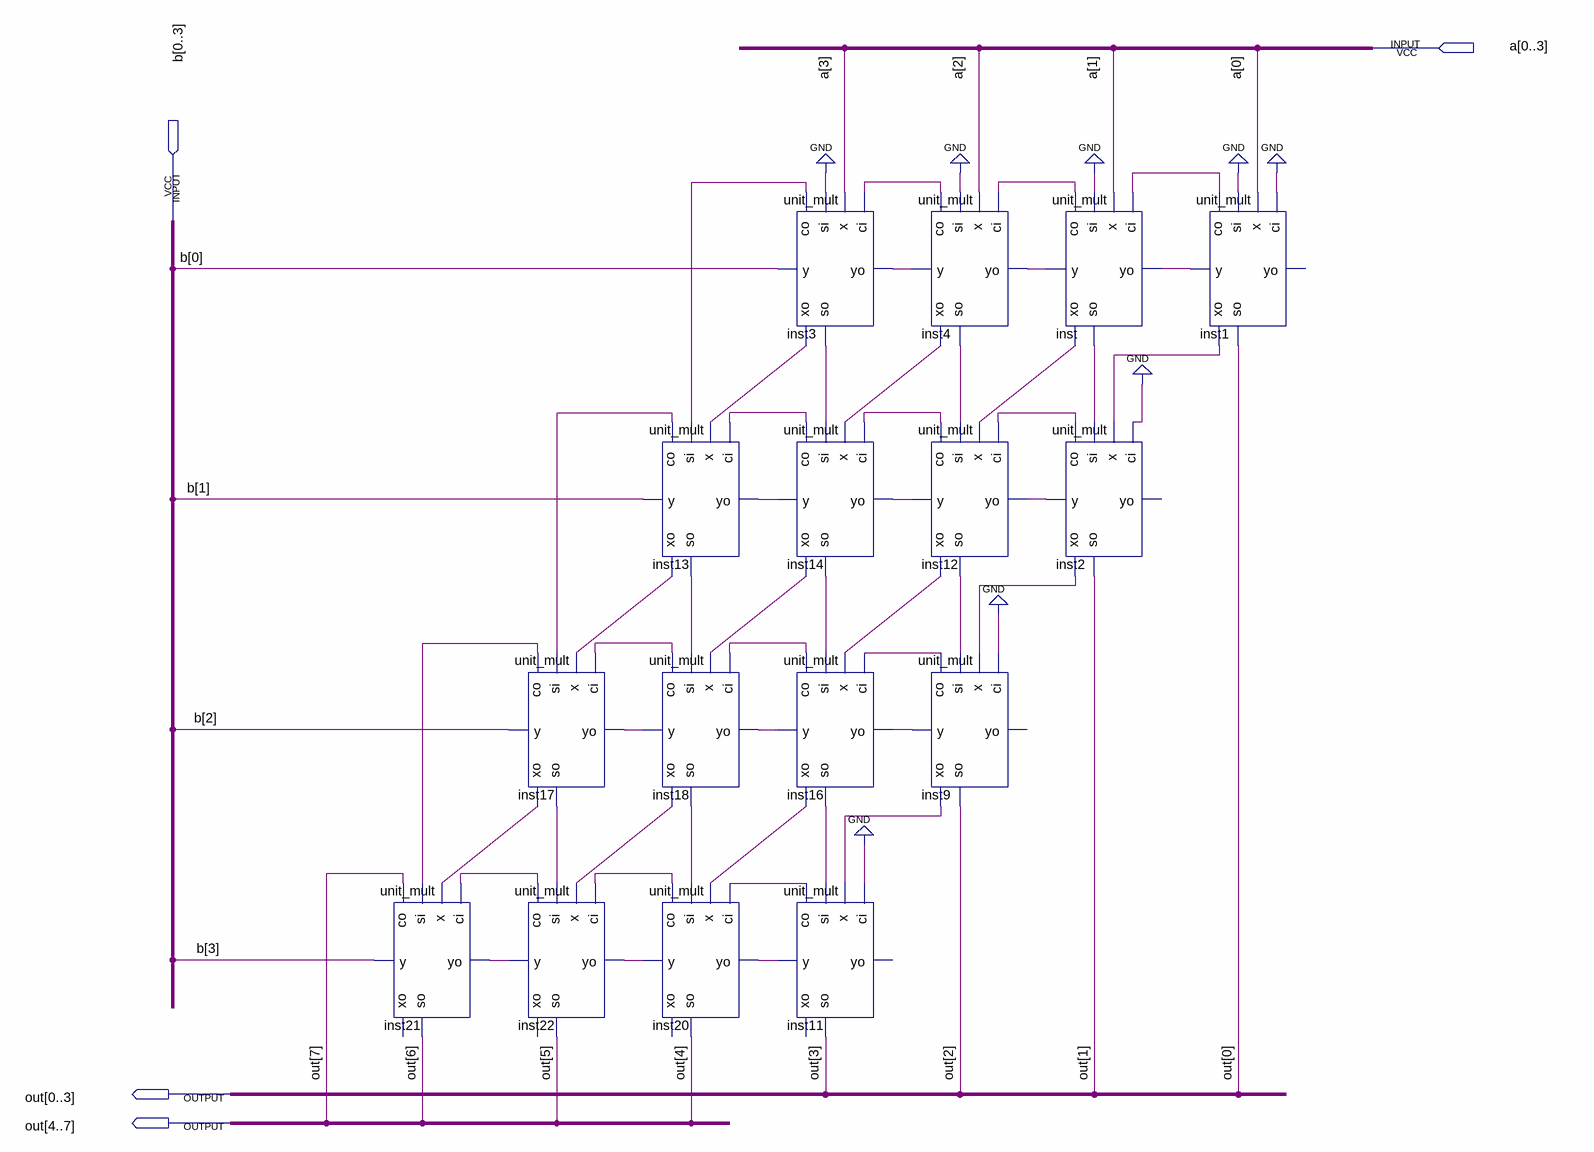
[diagram p0: schematic sheet]
// Quartus schematic 4bit_mult.bdf as structural Verilog: 16 symbols, 4 pins
module \4bit_mult  (
  input  [0:3] a,
  input  [0:3] b,
  output [0:7] out
);

  wire inst1_co, inst1_xo, inst2_co, inst2_xo, inst3_co, inst3_so, inst3_xo, inst3_yo, inst4_co, inst4_so,
       inst4_xo, inst4_yo, inst9_co, inst9_xo, inst11_co, inst12_co, inst12_so, inst12_xo, inst12_yo,
       inst13_co, inst13_so, inst13_xo, inst13_yo, inst14_co, inst14_so, inst14_xo, inst14_yo, inst16_co,
       inst16_so, inst16_xo, inst16_yo, inst17_co, inst17_so, inst17_xo, inst17_yo, inst18_co, inst18_so,
       inst18_xo, inst18_yo, inst20_co, inst20_yo, inst21_yo, inst22_co, inst22_yo, inst_co, inst_so,
       inst_xo, inst_yo;

  unit_mult inst21 (
    .x(inst17_xo), .ci(inst22_co), .y(b[3]), .si(inst17_co), .yo(inst21_yo), .co(out[7]), .so(out[6]));  // open: xo
  unit_mult inst17 (
    .x(inst13_xo), .ci(inst18_co), .y(b[2]), .si(inst13_co), .yo(inst17_yo), .xo(inst17_xo), .co(inst17_co),
    .so(inst17_so));
  unit_mult inst22 (
    .x(inst18_xo), .ci(inst20_co), .y(inst21_yo), .si(inst17_so), .yo(inst22_yo), .co(inst22_co), .so(out[5]));  // open: xo
  unit_mult inst13 (
    .x(inst3_xo), .ci(inst14_co), .y(b[1]), .si(inst3_co), .yo(inst13_yo), .xo(inst13_xo), .co(inst13_co),
    .so(inst13_so));
  unit_mult inst18 (
    .x(inst14_xo), .ci(inst16_co), .y(inst17_yo), .si(inst13_so), .yo(inst18_yo), .xo(inst18_xo),
    .co(inst18_co), .so(inst18_so));
  unit_mult inst20 (
    .x(inst16_xo), .ci(inst11_co), .y(inst22_yo), .si(inst18_so), .yo(inst20_yo), .co(inst20_co), .so(out[4]));  // open: xo
  unit_mult inst3 (
    .x(a[3]), .ci(inst4_co), .y(b[0]), .si(1'b0), .yo(inst3_yo), .xo(inst3_xo), .co(inst3_co), .so(inst3_so));
  unit_mult inst14 (
    .x(inst4_xo), .ci(inst12_co), .y(inst13_yo), .si(inst3_so), .yo(inst14_yo), .xo(inst14_xo),
    .co(inst14_co), .so(inst14_so));
  unit_mult inst16 (
    .x(inst12_xo), .ci(inst9_co), .y(inst18_yo), .si(inst14_so), .yo(inst16_yo), .xo(inst16_xo),
    .co(inst16_co), .so(inst16_so));
  unit_mult inst11 (
    .x(inst9_xo), .ci(1'b0), .y(inst20_yo), .si(inst16_so), .co(inst11_co), .so(out[3]));  // open: yo, xo
  unit_mult inst4 (
    .x(a[2]), .ci(inst_co), .y(inst3_yo), .si(1'b0), .yo(inst4_yo), .xo(inst4_xo), .co(inst4_co),
    .so(inst4_so));
  unit_mult inst12 (
    .x(inst_xo), .ci(inst2_co), .y(inst14_yo), .si(inst4_so), .yo(inst12_yo), .xo(inst12_xo), .co(inst12_co),
    .so(inst12_so));
  unit_mult inst9 (
    .x(inst2_xo), .ci(1'b0), .y(inst16_yo), .si(inst12_so), .xo(inst9_xo), .co(inst9_co), .so(out[2]));  // open: yo
  unit_mult inst (
    .x(a[1]), .ci(inst1_co), .y(inst4_yo), .si(1'b0), .yo(inst_yo), .xo(inst_xo), .co(inst_co), .so(inst_so));
  unit_mult inst2 (
    .x(inst1_xo), .ci(1'b0), .y(inst12_yo), .si(inst_so), .xo(inst2_xo), .co(inst2_co), .so(out[1]));  // open: yo
  unit_mult inst1 (.x(a[0]), .ci(1'b0), .y(inst_yo), .si(1'b0), .xo(inst1_xo), .co(inst1_co), .so(out[0]));  // open: yo
endmodule
